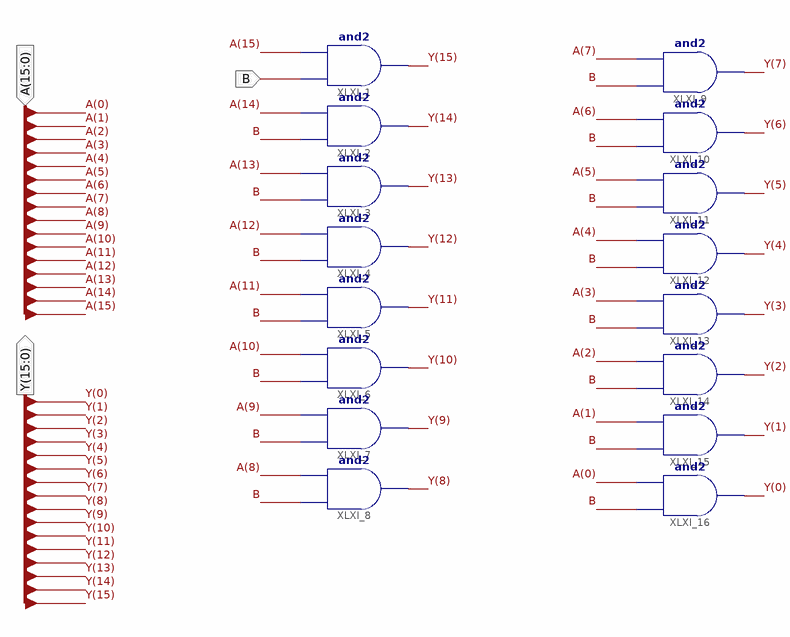
[diagram p0: schematic sheet 1]
// Xilinx ISE schematic AND16_1.sch (virtex6) as structural Verilog: 16 symbols, 3 ports
module AND16_1 (
  input  B,
  input  [15:0] A,
  output [15:0] Y
);

  and XLXI_1 (Y[15], B, A[15]);
  and XLXI_2 (Y[14], B, A[14]);
  and XLXI_3 (Y[13], B, A[13]);
  and XLXI_4 (Y[12], B, A[12]);
  and XLXI_5 (Y[11], B, A[11]);
  and XLXI_6 (Y[10], B, A[10]);
  and XLXI_7 (Y[9], B, A[9]);
  and XLXI_8 (Y[8], B, A[8]);
  and XLXI_9 (Y[7], B, A[7]);
  and XLXI_10 (Y[6], B, A[6]);
  and XLXI_11 (Y[5], B, A[5]);
  and XLXI_12 (Y[4], B, A[4]);
  and XLXI_13 (Y[3], B, A[3]);
  and XLXI_14 (Y[2], B, A[2]);
  and XLXI_15 (Y[1], B, A[1]);
  and XLXI_16 (Y[0], B, A[0]);
endmodule
